# EAGLE schematic uTTA_V2.2_Measure (EAGLE 6.3)
VERSION: 2.2
Assembly variants: Manual_Adjust, Controller Adjust, Optional_content

## Sheet 1 of 5: uC & Flash
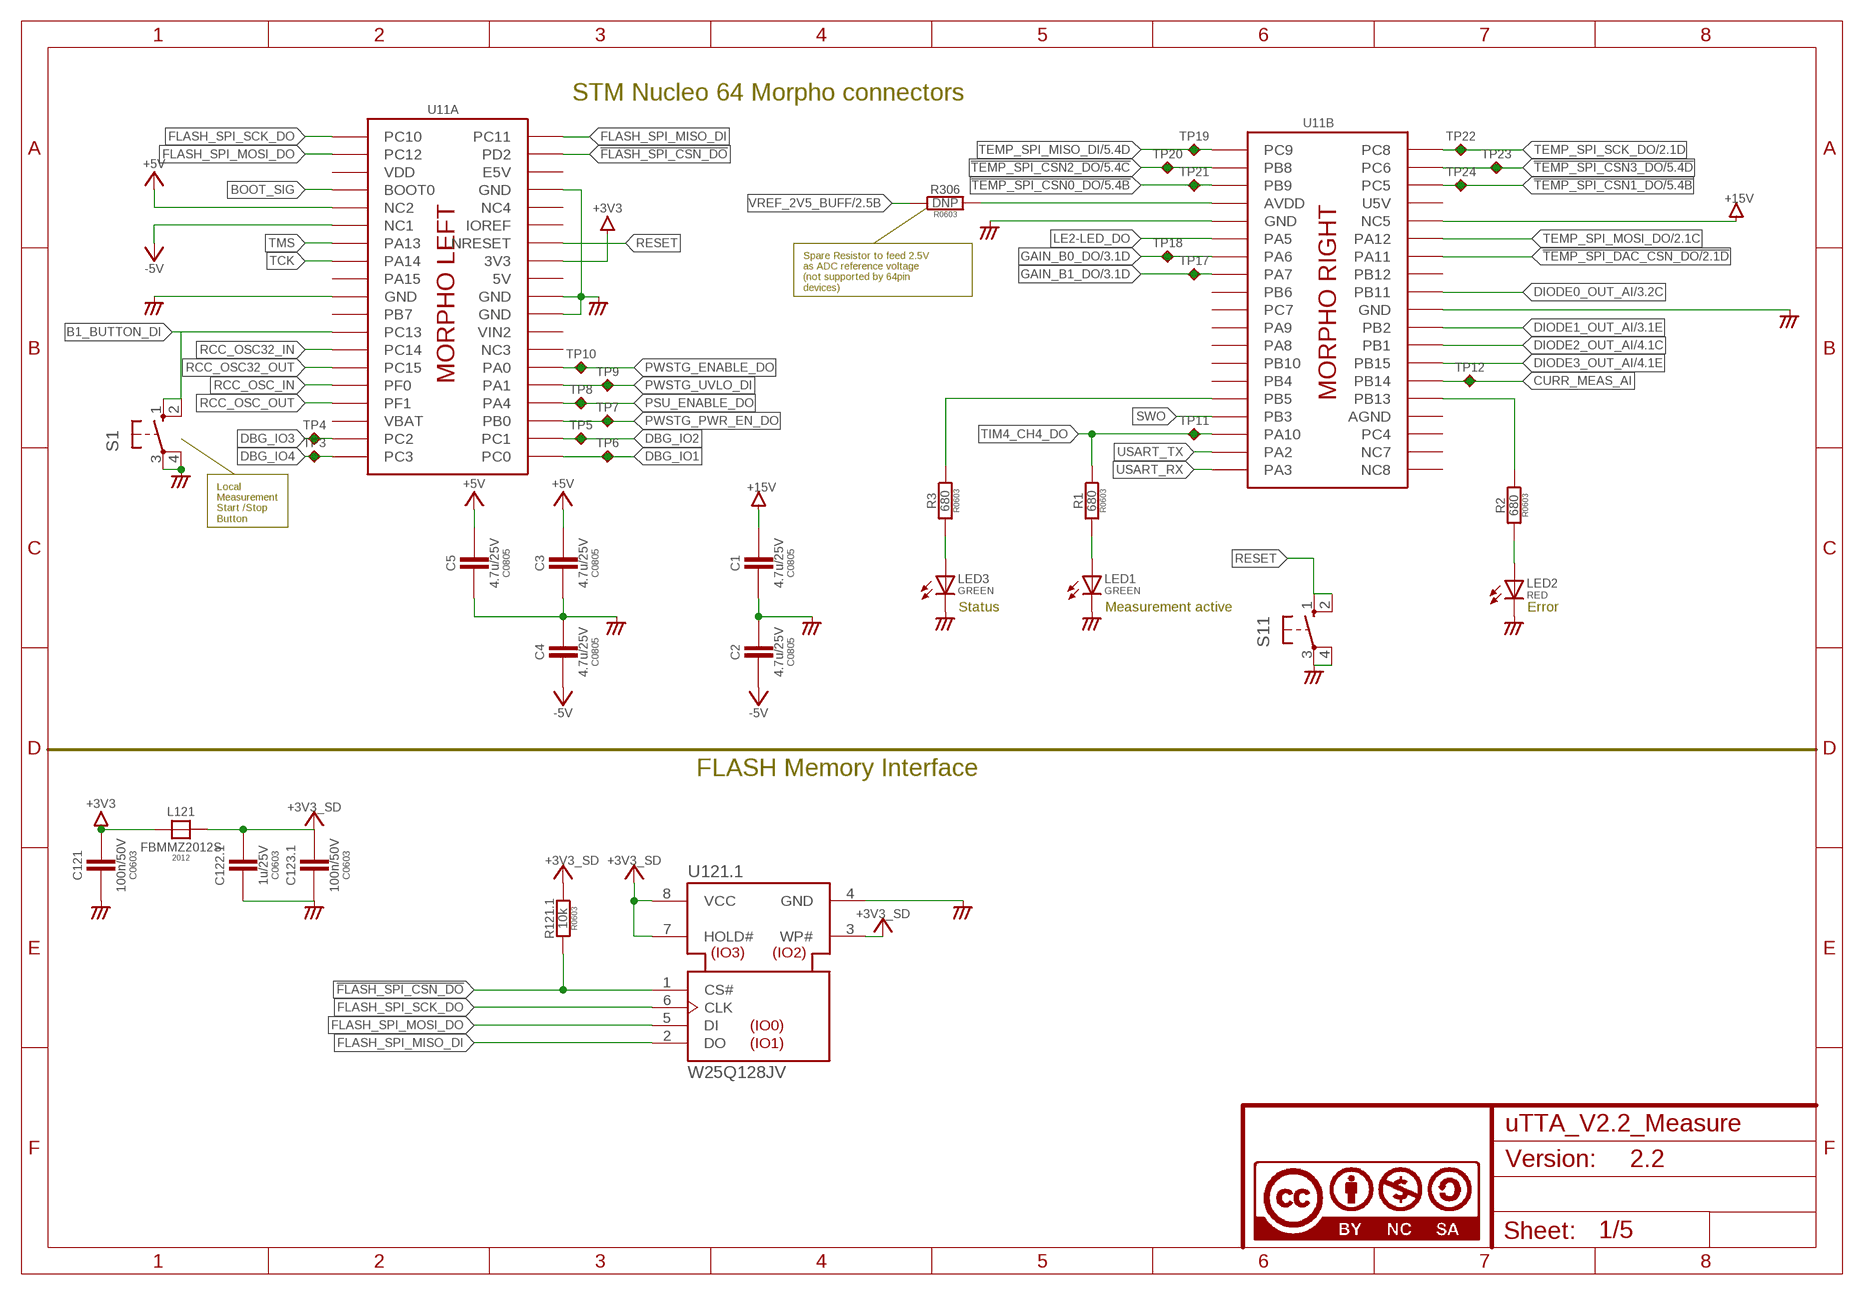
[diagram p0: schematic, sheet 1]

### Parts
C1  4.7u/25V  C-EUC0805  [C0805]  (not fitted in variant Manual_Adjust)  (not fitted in variant Controller Adjust)
C2  4.7u/25V  C-EUC0805  [C0805]  (not fitted in variant Manual_Adjust)  (not fitted in variant Controller Adjust)
C3  4.7u/25V  C-EUC0805  [C0805]  (not fitted in variant Manual_Adjust)  (not fitted in variant Controller Adjust)
C4  4.7u/25V  C-EUC0805  [C0805]  (not fitted in variant Manual_Adjust)  (not fitted in variant Controller Adjust)
C5  4.7u/25V  C-EUC0805  [C0805]  (not fitted in variant Manual_Adjust)  (not fitted in variant Controller Adjust)
C121  100n/50V  C-EUC0603  [C0603]
C122.1  1u/25V  C-EUC0603  [C0603]
C123.1  100n/50V  C-EUC0603  [C0603]
L121  FBMMZ2012S  [FB2012]
LED1  GREEN  LEDSML0805  [SML0805]
LED2  RED  LEDSML0805  [SML0805]
LED3  GREEN  LEDSML0805  [SML0805]
R1  680  R-EU_R0603  [R0603]
R2  680  R-EU_R0603  [R0603]
R3  680  R-EU_R0603  [R0603]
R121.1  10k  R-EU_R0603  [R0603]
R306  DNP  R-EU_R0603  [R0603]
S1  10-XX  [B3F-10XX]
S11  10-XX  [B3F-10XX]
TP3  TPC90H30  [C90H30]
TP4  TPC90H30  [C90H30]
TP5  TPC90H30  [C90H30]
TP6  TPC90H30  [C90H30]
TP7  TPC90H30  [C90H30]
TP8  TPC90H30  [C90H30]
TP9  TPC90H30  [C90H30]
TP10  TPC90H30  [C90H30]
TP11  TPC90H30  [C90H30]
TP12  TPC90H30  [C90H30]
TP17  TPC90H30  [C90H30]
TP18  TPC90H30  [C90H30]
TP19  TPC90H30  [C90H30]
TP20  TPC90H30  [C90H30]
TP21  TPC90H30  [C90H30]
TP22  TPC90H30  [C90H30]
TP23  TPC90H30  [C90H30]
TP24  TPC90H30  [C90H30]
U11  NUCLEO_F103_BOT  [NUCLEO_BRD64_LOWER]
U121.1  W25Q128JV  W25Q80BVSSIG  [SO08W]

### Nets
!FLASH_SPI_CSN_DO [Digital_Sig]: R121.1.2 U11.L_PD2(A:PD2) U121.1.1(CS#)
!TEMP_SPI_CSN0_DO [Digital_Sig]: TP21.P$1(TP) U11.R_PB9(B:PB9) ; also sheet 5
!TEMP_SPI_CSN1_DO [Digital_Sig]: TP24.P$1(TP) U11.R_PC5(B:PC5) ; also sheet 5
!TEMP_SPI_CSN2_DO [Digital_Sig]: TP20.P$1(TP) U11.R_PB8(B:PB8) ; also sheet 5
!TEMP_SPI_CSN3_DO [Digital_Sig]: TP23.P$1(TP) U11.R_PC6(B:PC6) ; also sheet 5
!TEMP_SPI_DAC_CSN_DO [Digital_Sig]: U11.R_PA11(B:PA11) ; also sheet 2
+3V3 [Power_<10V]: C121.1 L121.1 U11.L_3V3(A:3V3) ; also sheet 2,3,4,5
+5V [Power_<10V]: C3.1 C5.1 U11.L_NC2(A:NC2) ; also sheet 2,3,4
+5V/4 [Power_<10V]: C122.1.1 C123.1.1 L121.2 R121.1.1 U121.1.3(WP#) U121.1.7(HOLD#) U121.1.8(VCC) ; supply symbol labelled +3V3_SD
+15V [Power_>10V]: C1.1 U11.R_NC5(B:NC5) ; also sheet 2
-5V [Power_<10V]: C2.2 C4.2 U11.L_NC1(A:NC1) ; also sheet 2,3,4
AGND [GND]: C1.2 C2.1 C3.2 C4.1 C5.2 C121.2 C122.1.2 C123.1.2 LED1.C LED2.C LED3.C S1.3(P) S1.4(P1) S11.3(P) S11.4(P1) U11.L_GND3(A:GND) U11.L_GND4(A:GND) U11.L_GND5(A:GND) U11.L_GND(A:GND) U11.R_GND7(B:GND) U11.R_GND8(B:GND) U121.1.4(GND) ; supply symbol labelled AGND_ ; also sheet 2,3,4,5
B1_BUTTON_DI [Digital_Sig]: S1.1(S) S1.2(S1) U11.L_PC13(A:PC13)
BOOT_SIG: U11.L_BOOT0(A:BOOT0)
CURR_MEAS_AI [Analog_Sig]: TP12.P$1(TP) U11.R_PB14(B:PB14)
DBG_IO1: TP6.P$1(TP) U11.L_PC0(A:PC0)
DBG_IO2: TP5.P$1(TP) U11.L_PC1(A:PC1)
DBG_IO3: TP4.P$1(TP) U11.L_PC2(A:PC2)
DBG_IO4: TP3.P$1(TP) U11.L_PC3(A:PC3)
DIODE0_OUT_AI [Analog_Sig]: U11.R_PB11(B:PB11) ; also sheet 3
DIODE1_OUT_AI [Analog_Sig]: U11.R_PB2(B:PB2) ; also sheet 3
DIODE2_OUT_AI [Analog_Sig]: U11.R_PB1(B:PB1) ; also sheet 4
DIODE3_OUT_AI [Analog_Sig]: U11.R_PB15(B:PB15) ; also sheet 4
FLASH_SPI_MISO_DI [Digital_Sig]: U11.L_PC11(A:PC11) U121.1.2(DO)
FLASH_SPI_MOSI_DO [Digital_Sig]: U11.L_PC12(A:PC12) U121.1.5(DI)
FLASH_SPI_SCK_DO [Digital_Sig]: U11.L_PC10(A:PC10) U121.1.6(CLK)
GAIN_B0_DO [Digital_Sig]: TP18.P$1(TP) U11.R_PA6(B:PA6) ; also sheet 3
GAIN_B1_DO [Digital_Sig]: TP17.P$1(TP) U11.R_PA7(B:PA7) ; also sheet 3
LE2-LED_DO: U11.R_PA5(B:PA5)
N$4 [Digital_Sig]: LED2.A R2.2
N$5 [Digital_Sig]: LED3.A R3.2
N$54 [Digital_Sig]: LED1.A R1.2
PSU_ENABLE_DO [Digital_Sig]: TP8.P$1(TP) U11.L_PA4(A:PA4)
PWSTG_ENABLE_DO [Digital_Sig]: TP10.P$1(TP) U11.L_PA0(A:PA0)
PWSTG_PWR_EN_DO [Digital_Sig]: TP7.P$1(TP) U11.L_PB0(A:PB0)
PWSTG_UVLO_DI [Digital_Sig]: TP9.P$1(TP) U11.L_PA1(A:PA1)
RCC_OSC32_IN: U11.L_PC14(A:PC14)
RCC_OSC32_OUT: U11.L_PC15(A:PC15)
RCC_OSC_IN: U11.L_PF0(A:PF0)
RCC_OSC_OUT: U11.L_PF1(A:PF1)
RESET [Power_>10V]: S11.1(S) S11.2(S1) U11.L_RESET(A:NRESET)
SWO: U11.R_PB3(B:PB3)
TCK: U11.L_PA14(A:PA14)
TEMP_SPI_MISO_DI [Digital_Sig]: TP19.P$1(TP) U11.R_PC9(B:PC9) ; also sheet 5
TEMP_SPI_MOSI_DO [Digital_Sig]: U11.R_PA12(B:PA12) ; also sheet 2
TEMP_SPI_SCK_DO [Digital_Sig]: TP22.P$1(TP) U11.R_PC8(B:PC8) ; also sheet 2,5
TIM4_CH4_DO [Digital_Sig]: R1.1 TP11.P$1(TP) U11.R_PA10(B:PA10)
TIM4_CH4_DO1 [Digital_Sig]: R2.1 U11.R_PB13(B:PB13)
TIM4_CH4_DO2 [Digital_Sig]: R3.1 U11.R_PB5(B:PB5)
TMS: U11.L_PA13(A:PA13)
USART_RX: U11.R_PA3(B:PA3)
USART_TX: U11.R_PA2(B:PA2)
VREF_2V5_ADCREF [Analog_Sig]: R306.2 U11.R_AVDD(B:AVDD)
VREF_2V5_BUFF [Analog_Sig]: R306.1 ; also sheet 2
Unconnected: U11.L_IOREF(A:IOREF) U11.L_NC3(A:NC3) U11.L_NC4(A:NC4) U11.L_PA15(A:PA15) U11.L_PB7(A:PB7) U11.R_NC7(B:NC7) U11.R_NC8(B:NC8) U11.R_PA8(B:PA8) U11.R_PA9(B:PA9) U11.R_PB4(B:PB4) U11.R_PB6(B:PB6) U11.R_PB10(B:PB10) U11.R_PB12(B:PB12) U11.R_PC4(B:PC4) U11.R_PC7(B:PC7)

### Notes on the sheet
- STM Nucleo 64 Morpho connectors
- Spare Resistor to feed 2.5V 
  as ADC reference voltage
  (not supported by 64pin
  devices)
- Local
  Measurement
  Start /Stop
  Button
- Status | Measurement active | Error
- FLASH Memory Interface

## Sheet 2 of 5
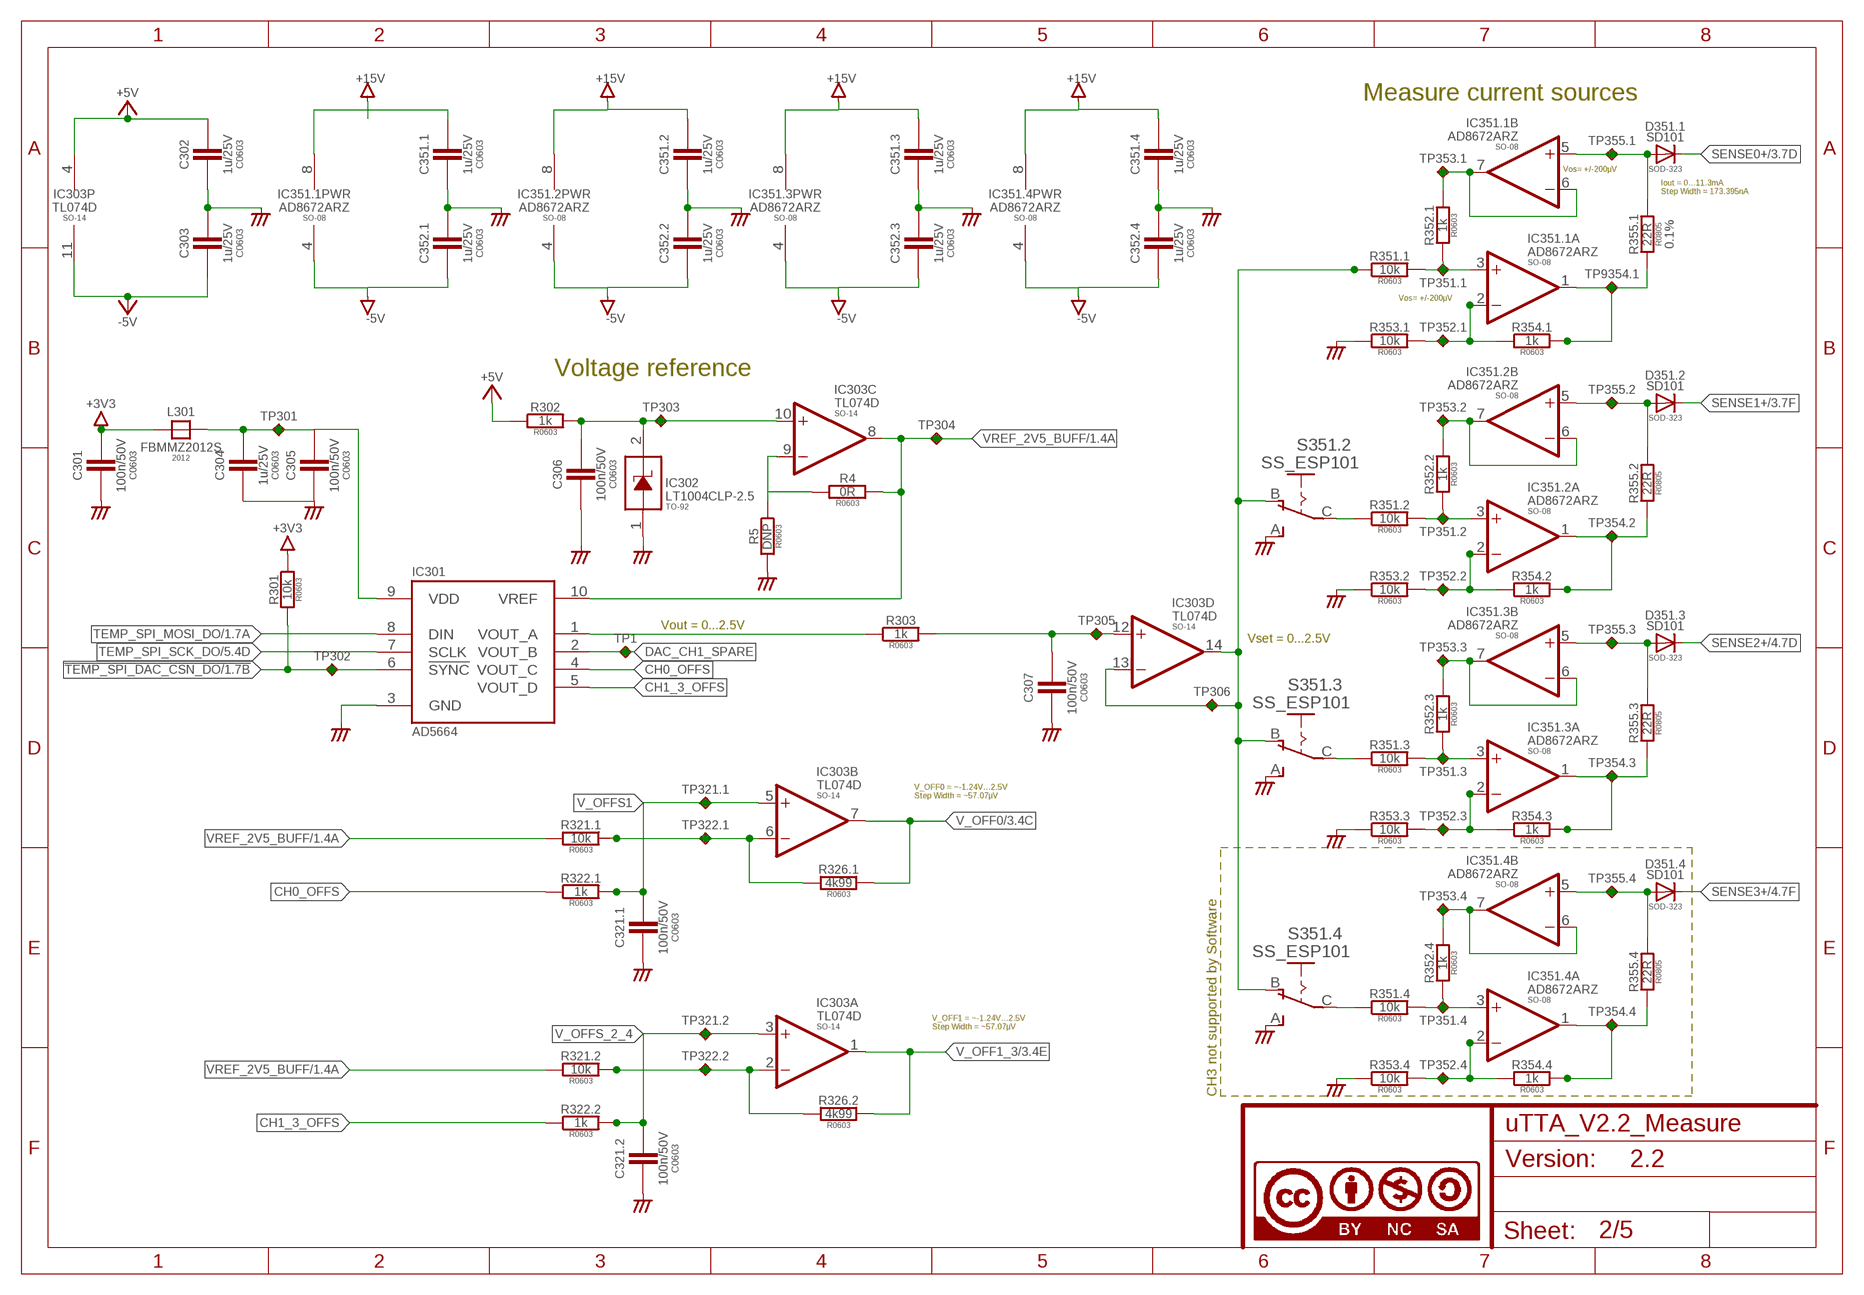
[diagram p1: schematic, sheet 2]

### Parts
C301  100n/50V  C-EUC0603  [C0603]  (not fitted in variant Manual_Adjust)
C302  1u/25V  C-EUC0603  [C0603]
C303  1u/25V  C-EUC0603  [C0603]
C304  1u/25V  C-EUC0603  [C0603]
C305  100n/50V  C-EUC0603  [C0603]  (not fitted in variant Manual_Adjust)
C306  100n/50V  C-EUC0603  [C0603]
C307  100n/50V  C-EUC0603  [C0603]
C321.1  100n/50V  C-EUC0603  [C0603]
C321.2  100n/50V  C-EUC0603  [C0603]
C351.1  1u/25V  C-EUC0603  [C0603]
C351.2  1u/25V  C-EUC0603  [C0603]
C351.3  1u/25V  C-EUC0603  [C0603]
C351.4  1u/25V  C-EUC0603  [C0603]  (not fitted in variant Manual_Adjust)  (not fitted in variant Controller Adjust)
C352.1  1u/25V  C-EUC0603  [C0603]
C352.2  1u/25V  C-EUC0603  [C0603]
C352.3  1u/25V  C-EUC0603  [C0603]
C352.4  1u/25V  C-EUC0603  [C0603]  (not fitted in variant Manual_Adjust)  (not fitted in variant Controller Adjust)
D351.1  SD101  SD101AWS  [SOD323-R]
D351.2  SD101  SD101AWS  [SOD323-R]
D351.3  SD101  SD101AWS  [SOD323-R]
D351.4  SD101  SD101AWS  [SOD323-R]  (not fitted in variant Manual_Adjust)  (not fitted in variant Controller Adjust)
IC301  AD5664  AD5664R  [MSOP10]  (not fitted in variant Manual_Adjust)
IC302  LT1004CLP-2.5  [TO92-]
IC303  TL074D  [SO14]
IC351.1  AD8672ARZ  OPA2156ID  [SO08]
IC351.2  AD8672ARZ  OPA2156ID  [SO08]
IC351.3  AD8672ARZ  OPA2156ID  [SO08]
IC351.4  AD8672ARZ  OPA2156ID  [SO08]  (not fitted in variant Manual_Adjust)  (not fitted in variant Controller Adjust)
L301  FBMMZ2012S  [FB2012]  (not fitted in variant Manual_Adjust)
R4  0R  R-EU_R0603  [R0603]
R5  DNP  R-EU_R0603  [R0603]
R301  10k  R-EU_R0603  [R0603]  (not fitted in variant Manual_Adjust)
R302  1k  R-EU_R0603  [R0603]
R303  1k  R-EU_R0603  [R0603]  (not fitted in variant Manual_Adjust)
R321.1  10k  R-EU_R0603  [R0603]
R321.2  10k  R-EU_R0603  [R0603]
R322.1  1k  R-EU_R0603  [R0603]  (not fitted in variant Manual_Adjust)
R322.2  1k  R-EU_R0603  [R0603]  (not fitted in variant Manual_Adjust)
R326.1  4k99  R-EU_R0603  [R0603]
R326.2  4k99  R-EU_R0603  [R0603]
R351.1  10k  R-EU_R0603  [R0603]
R351.2  10k  R-EU_R0603  [R0603]
R351.3  10k  R-EU_R0603  [R0603]
R351.4  10k  R-EU_R0603  [R0603]  (not fitted in variant Manual_Adjust)  (not fitted in variant Controller Adjust)
R352.1  1k  R-EU_R0603  [R0603]
R352.2  1k  R-EU_R0603  [R0603]
R352.3  1k  R-EU_R0603  [R0603]
R352.4  1k  R-EU_R0603  [R0603]  (not fitted in variant Manual_Adjust)  (not fitted in variant Controller Adjust)
R353.1  10k  R-EU_R0603  [R0603]
R353.2  10k  R-EU_R0603  [R0603]
R353.3  10k  R-EU_R0603  [R0603]
R353.4  10k  R-EU_R0603  [R0603]  (not fitted in variant Manual_Adjust)  (not fitted in variant Controller Adjust)
R354.1  1k  R-EU_R0603  [R0603]
R354.2  1k  R-EU_R0603  [R0603]
R354.3  1k  R-EU_R0603  [R0603]
R354.4  1k  R-EU_R0603  [R0603]  (not fitted in variant Manual_Adjust)  (not fitted in variant Controller Adjust)
R355.1  22R  R-EU_R0805  [R0805]
R355.2  22R  R-EU_R0805  [R0805]
R355.3  22R  R-EU_R0805  [R0805]
R355.4  22R  R-EU_R0805  [R0805]  (not fitted in variant Manual_Adjust)  (not fitted in variant Controller Adjust)
S351.2  SS_ESP101  [SS_ESP101]
S351.3  SS_ESP101  [SS_ESP101]
S351.4  SS_ESP101  [SS_ESP101]  (not fitted in variant Manual_Adjust)  (not fitted in variant Controller Adjust)
TP1  TPC90  [C90]
TP301  TPC90  [C90]
TP302  TPC90  [C90]
TP303  TPC90H30  [C90H30]
TP304  TPC90  [C90]
TP305  TPC90H30  [C90H30]
TP306  TPC90  [C90]
TP321.1  TPC90  [C90]
TP321.2  TPC90  [C90]
TP322.1  TPC90  [C90]
TP322.2  TPC90  [C90]
TP351.1  TPC90  [C90]
TP351.2  TPC90  [C90]
TP351.3  TPC90  [C90]
TP351.4  TPC90  [C90]
TP352.1  TPC90  [C90]
TP352.2  TPC90  [C90]
TP352.3  TPC90  [C90]
TP352.4  TPC90  [C90]
TP353.1  TPC90  [C90]
TP353.2  TPC90  [C90]
TP353.3  TPC90  [C90]
TP353.4  TPC90  [C90]
TP354.2  TPC90  [C90]
TP354.3  TPC90  [C90]
TP354.4  TPC90  [C90]
TP355.1  TPC90  [C90]
TP355.2  TPC90  [C90]
TP355.3  TPC90  [C90]
TP355.4  TPC90  [C90]
TP9354.1  TPC90  [C90]

### Nets
3V3_DAC [Power_<10V]: C304.1 C305.1 IC301.9(VDD) L301.2 TP301.P$1(TP)
!TEMP_SPI_DAC_CSN_DO [Digital_Sig]: IC301.6(!SYNC) R301.2 TP302.P$1(TP) ; also sheet 1
+3V3 [Power_<10V]: C301.1 L301.1 R301.1 ; also sheet 1,3,4,5
+5V [Power_<10V]: C302.1 IC303.4(P:V+) R302.1 ; also sheet 1,3,4
+15V [Power_>10V]: C351.1.1 C351.2.1 C351.3.1 C351.4.1 IC351.1.8(PWR:V+) IC351.2.8(PWR:V+) IC351.3.8(PWR:V+) IC351.4.8(PWR:V+) ; also sheet 1
-5V [Power_<10V]: C303.2 C352.1.2 C352.2.2 C352.3.2 C352.4.2 IC303.11(P:V-) IC351.1.4(PWR:V-) IC351.2.4(PWR:V-) IC351.3.4(PWR:V-) IC351.4.4(PWR:V-) ; also sheet 1,3,4
AGND [GND]: C301.2 C302.2 C303.1 C304.2 C305.2 C306.2 C307.2 C321.1.2 C321.2.2 C351.1.2 C351.2.2 C351.3.2 C351.4.2 C352.1.1 C352.2.1 C352.3.1 C352.4.1 IC301.3(GND) IC302.1(A) R5.2 R353.1.1 R353.2.1 R353.3.1 R353.4.1 S351.2.A(S) S351.3.A(S) S351.4.A(S) ; supply symbol labelled AGND_ ; also sheet 1,3,4,5
CH0_OFFS [Analog_Sig]: IC301.4(VOUT_C) R322.1.1
CH1_3_OFFS [Analog_Sig]: IC301.5(VOUT_D) R322.2.1
DAC_CH1_SPARE [Analog_Sig]: IC301.2(VOUT_B) TP1.P$1(TP)
I_SENSE_DAC_SET [Analog_Sig]: IC301.1(VOUT_A) R303.1
ISEN_FB1 [Analog_Sig]: D351.1.A IC351.1.5(B:+IN) R355.1.2 TP355.1.P$1(TP)
ISEN_FB2 [Analog_Sig]: D351.2.A IC351.2.5(B:+IN) R355.2.2 TP355.2.P$1(TP)
ISEN_FB3 [Analog_Sig]: D351.3.A IC351.3.5(B:+IN) R355.3.2 TP355.3.P$1(TP)
ISEN_FB4 [Analog_Sig]: D351.4.A IC351.4.5(B:+IN) R355.4.2 TP355.4.P$1(TP)
ISEN_FB_OUT1 [Analog_Sig]: IC351.1.6(B:-IN) IC351.1.7(B:OUT) R352.1.2 TP353.1.P$1(TP)
ISEN_FB_OUT2 [Analog_Sig]: IC351.2.6(B:-IN) IC351.2.7(B:OUT) R352.2.2 TP353.2.P$1(TP)
ISEN_FB_OUT3 [Analog_Sig]: IC351.3.6(B:-IN) IC351.3.7(B:OUT) R352.3.2 TP353.3.P$1(TP)
ISEN_FB_OUT4 [Analog_Sig]: IC351.4.6(B:-IN) IC351.4.7(B:OUT) R352.4.2 TP353.4.P$1(TP)
ISEN_FB_SUM1 [Analog_Sig]: IC351.1.2(A:-IN) R353.1.2 R354.1.1 TP352.1.P$1(TP)
ISEN_FB_SUM2 [Analog_Sig]: IC351.2.2(A:-IN) R353.2.2 R354.2.1 TP352.2.P$1(TP)
ISEN_FB_SUM3 [Analog_Sig]: IC351.3.2(A:-IN) R353.3.2 R354.3.1 TP352.3.P$1(TP)
ISEN_FB_SUM4 [Analog_Sig]: IC351.4.2(A:-IN) R353.4.2 R354.4.1 TP352.4.P$1(TP)
ISEN_OUT1 [Analog_Sig]: IC351.1.1(A:OUT) R354.1.2 R355.1.1 TP9354.1.P$1(TP)
ISEN_OUT2 [Analog_Sig]: IC351.2.1(A:OUT) R354.2.2 R355.2.1 TP354.2.P$1(TP)
ISEN_OUT3 [Analog_Sig]: IC351.3.1(A:OUT) R354.3.2 R355.3.1 TP354.3.P$1(TP)
ISEN_OUT4 [Analog_Sig]: IC351.4.1(A:OUT) R354.4.2 R355.4.1 TP354.4.P$1(TP)
ISEN_SET2 [Analog_Sig]: R351.2.1 S351.2.C(P)
ISEN_SET3 [Analog_Sig]: R351.3.1 S351.3.C(P)
ISEN_SET4 [Analog_Sig]: R351.4.1 S351.4.C(P)
ISEN_SET_SUM1 [Analog_Sig]: IC351.1.3(A:+IN) R351.1.2 R352.1.1 TP351.1.P$1(TP)
ISEN_SET_SUM2 [Analog_Sig]: IC351.2.3(A:+IN) R351.2.2 R352.2.1 TP351.2.P$1(TP)
ISEN_SET_SUM3 [Analog_Sig]: IC351.3.3(A:+IN) R351.3.2 R352.3.1 TP351.3.P$1(TP)
ISEN_SET_SUM4 [Analog_Sig]: IC351.4.3(A:+IN) R351.4.2 R352.4.1 TP351.4.P$1(TP)
ISENS_SET [Analog_Sig]: IC303.13(D:-IN) IC303.14(D:OUT) R351.1.1 S351.2.B(O) S351.3.B(O) S351.4.B(O) TP306.P$1(TP)
ISENS_SET_IN [Analog_Sig]: C307.1 IC303.12(D:+IN) R303.2 TP305.P$1(TP)
N$3: IC303.9(C:-IN) R4.2 R5.1
SENSE0+ [Analog_Sig]: D351.1.C ; also sheet 3
SENSE1+ [Analog_Sig]: D351.2.C ; also sheet 3
SENSE2+ [Analog_Sig]: D351.3.C ; also sheet 4
SENSE3+ [Analog_Sig]: D351.4.C ; also sheet 4
TEMP_SPI_MOSI_DO [Digital_Sig]: IC301.8(DIN) ; also sheet 1
TEMP_SPI_SCK_DO [Digital_Sig]: IC301.7(SCLK) ; also sheet 1,5
V_OFF0 [Analog_Sig]: IC303.7(B:OUT) R326.1.1 ; also sheet 3
V_OFF1_3 [Analog_Sig]: IC303.1(A:OUT) R326.2.1 ; also sheet 3,4
V_OFFS1 [Analog_Sig]: C321.1.1 IC303.5(B:+IN) R322.1.2 TP321.1.P$1(TP)
V_OFFS_2_4 [Analog_Sig]: C321.2.1 IC303.3(A:+IN) R322.2.2 TP321.2.P$1(TP)
VOFFS_RR1 [Analog_Sig]: IC303.6(B:-IN) R321.1.1 R326.1.2 TP322.1.P$1(TP)
VOFFS_RR2_4 [Analog_Sig]: IC303.2(A:-IN) R321.2.1 R326.2.2 TP322.2.P$1(TP)
VREF [Analog_Sig]: C306.1 IC302.2(C) IC303.10(C:+IN) R302.2 TP303.P$1(TP)
VREF_2V5_BUFF [Analog_Sig]: IC301.10(VREF) IC303.8(C:OUT) R4.1 R321.1.2 R321.2.2 TP304.P$1(TP) ; also sheet 1

### Notes on the sheet
- Measure current sources
- Vos= +/-200µV
- Iout = 0...11.3mA
  Step Width = 173.395nA
- Vos= +/-200µV
- Voltage reference
- Vout = 0...2.5V
- Vset = 0...2.5V
- V_OFF0 = ~-1.24V...2.5V
  Step Width = ~57.07µV
- V_OFF1 = ~-1.24V...2.5V
  Step Width = ~57.07µV
- CH3 not supported by Software

## Sheet 3 of 5: Measure Channels 0 & 1
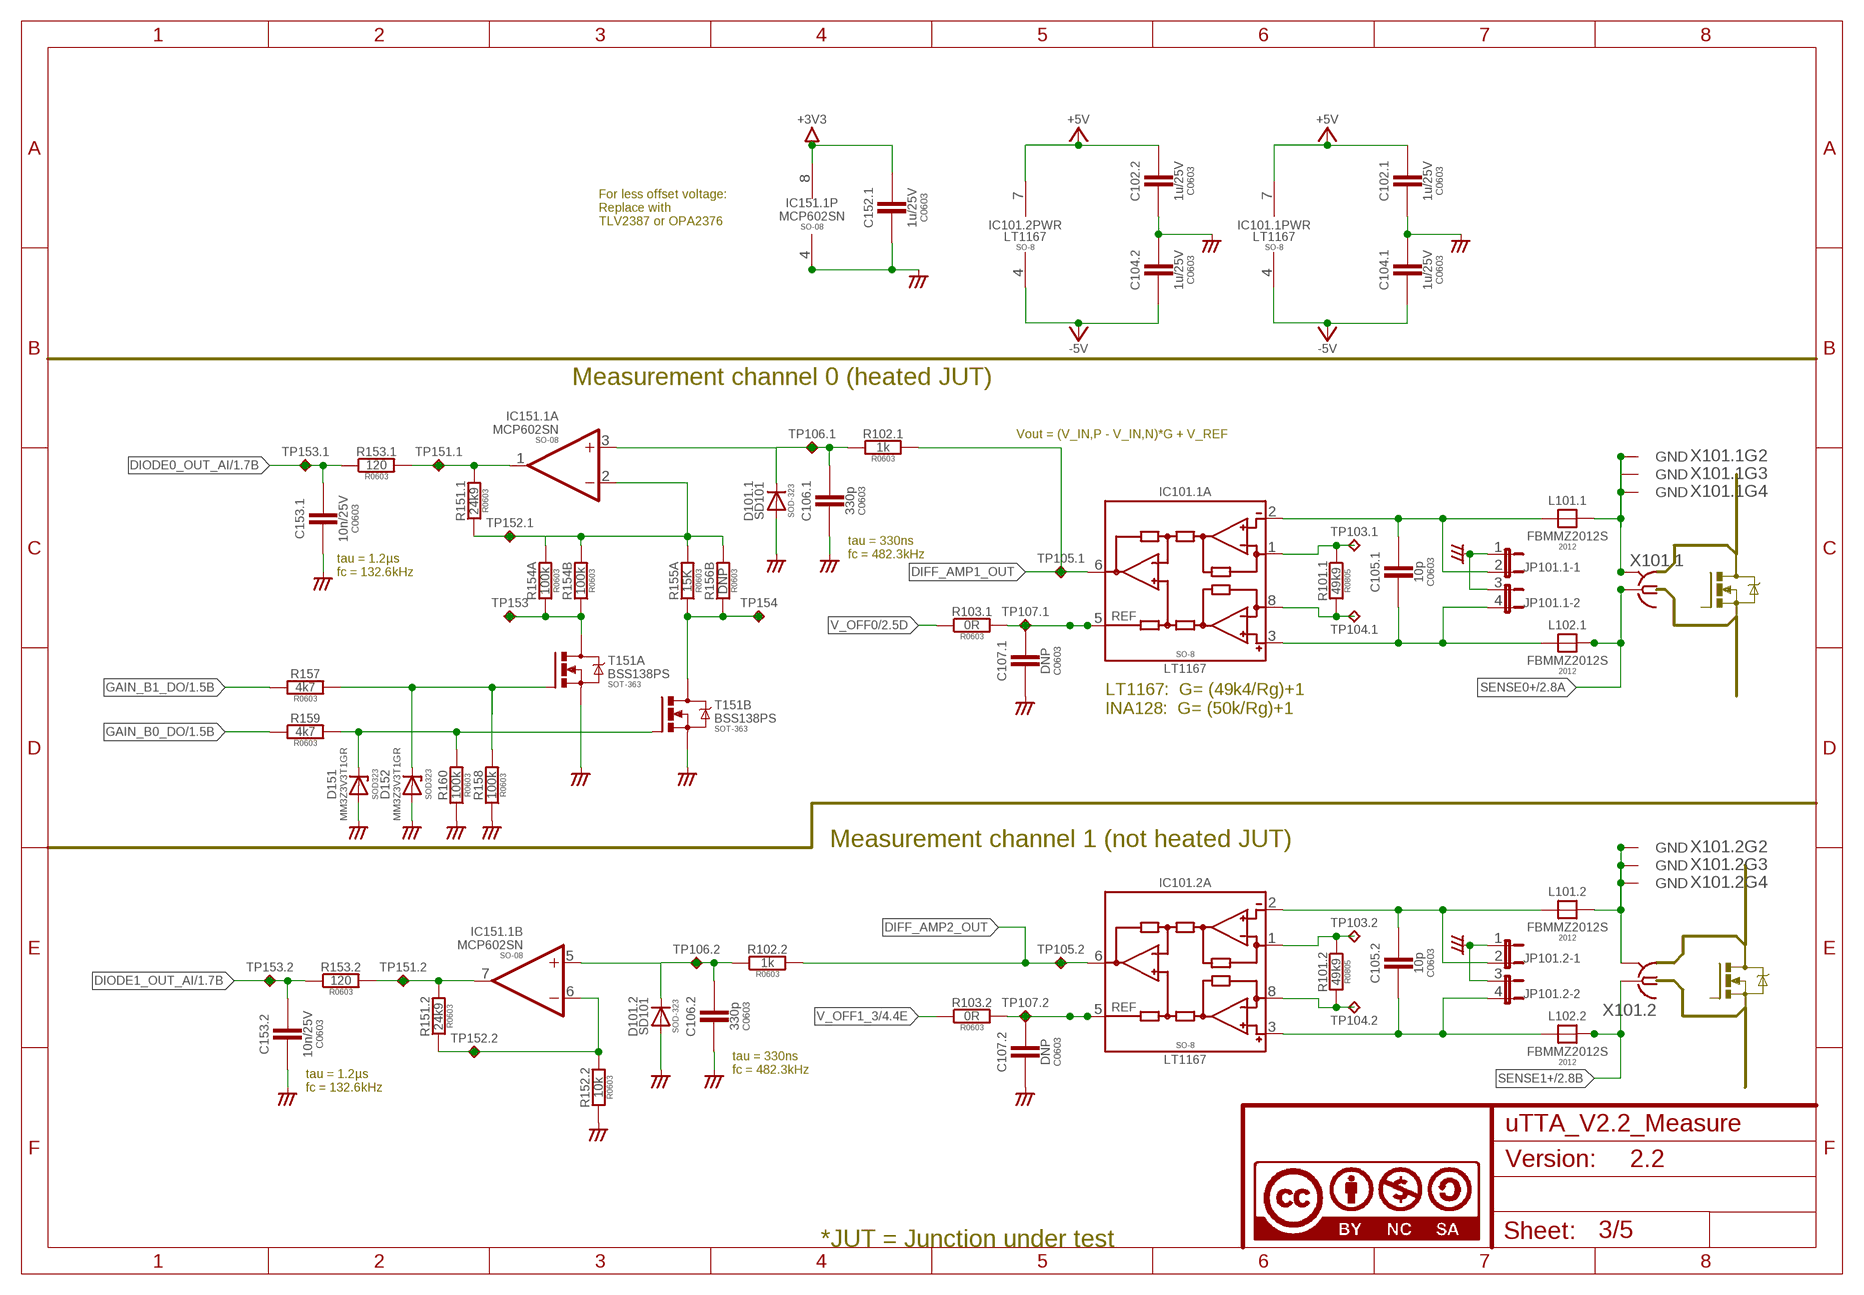
[diagram p2: schematic, sheet 3]

### Parts
C102.1  1u/25V  C-EUC0603  [C0603]
C102.2  1u/25V  C-EUC0603  [C0603]
C104.1  1u/25V  C-EUC0603  [C0603]
C104.2  1u/25V  C-EUC0603  [C0603]
C105.1  10p  C-EUC0603  [C0603]
C105.2  10p  C-EUC0603  [C0603]
C106.1  330p  C-EUC0603  [C0603]
C106.2  330p  C-EUC0603  [C0603]
C107.1  DNP  C-EUC0603  [C0603]
C107.2  DNP  C-EUC0603  [C0603]
C152.1  1u/25V  C-EUC0603  [C0603]
C153.1  10n/25V  C-EUC0603  [C0603]
C153.2  10n/25V  C-EUC0603  [C0603]
D101.1  SD101  SD101AWS  [SOD323-R]
D101.2  SD101  SD101AWS  [SOD323-R]
D151  MM3Z3V3T1GR  [SOD323-R]
D152  MM3Z3V3T1GR  [SOD323-R]
IC101.1  LT1167  [SO08]
IC101.2  LT1167  [SO08]
IC151.1  MCP602SN  [SO08]
JP101.1  JP2QE  [JP2Q]
JP101.2  JP2QE  [JP2Q]
L101.1  FBMMZ2012S  [FB2012]
L101.2  FBMMZ2012S  [FB2012]
L102.1  FBMMZ2012S  [FB2012]
L102.2  FBMMZ2012S  [FB2012]
R101.1  49k9  R-EU_R0805  [R0805]
R101.2  49k9  R-EU_R0805  [R0805]
R102.1  1k  R-EU_R0603  [R0603]
R102.2  1k  R-EU_R0603  [R0603]
R103.1  0R  R-EU_R0603  [R0603]
R103.2  0R  R-EU_R0603  [R0603]
R151.1  24k9  R-EU_R0603  [R0603]
R151.2  24k9  R-EU_R0603  [R0603]
R152.2  10k  R-EU_R0603  [R0603]
R153.1  120  R-EU_R0603  [R0603]
R153.2  120  R-EU_R0603  [R0603]
R154A  100k  R-EU_R0603  [R0603]
R154B  100k  R-EU_R0603  [R0603]
R155A  15K  R-EU_R0603  [R0603]
R156B  DNP  R-EU_R0603  [R0603]
R157  4k7  R-EU_R0603  [R0603]
R158  100k  R-EU_R0603  [R0603]
R159  4k7  R-EU_R0603  [R0603]
R160  100k  R-EU_R0603  [R0603]
T151  BSS138PS  [SOT363_PHILIPS]
TP103.1  TPC90  [C90]
TP103.2  TPC90  [C90]
TP104.1  TPC90  [C90]
TP104.2  TPC90  [C90]
TP105.1  TPC90  [C90]
TP105.2  TPC90  [C90]
TP106.1  TPC90H30  [C90H30]
TP106.2  TPC90H30  [C90H30]
TP107.1  TPC90  [C90]
TP107.2  TPC90  [C90]
TP151.1  TPC90H30  [C90H30]
TP151.2  TPC90H30  [C90H30]
TP152.1  TPC90  [C90]
TP152.2  TPC90  [C90]
TP153  TPC90  [C90]
TP153.1  TPC90H30  [C90H30]
TP153.2  TPC90H30  [C90H30]
TP154  TPC90  [C90]
X101.1  BU-SMA-GSPECIAL  [BU_SMA_3P]
X101.2  BU-SMA-GSPECIAL  [BU_SMA_3P]

### Nets
+3V3 [Power_<10V]: C152.1.1 IC151.1.8(P:V+) ; also sheet 1,2,4,5
+5V [Power_<10V]: C102.1.1 C102.2.1 IC101.1.7(PWR:V+) IC101.2.7(PWR:V+) ; also sheet 1,2,4
-5V [Power_<10V]: C104.1.2 C104.2.2 IC101.1.4(PWR:V-) IC101.2.4(PWR:V-) ; also sheet 1,2,4
AGND [GND]: C102.1.2 C102.2.2 C104.1.1 C104.2.1 C106.1.2 C106.2.2 C107.1.2 C107.2.2 C152.1.2 C153.1.2 C153.2.2 D101.1.A D101.2.A D151.A D152.A IC151.1.4(P:V-) JP101.1.1 JP101.1.3 JP101.2.1 JP101.2.3 R152.2.1 R158.1 R160.1 T151.1(A:S) T151.4(B:S) ; supply symbol labelled AGND_ ; also sheet 1,2,4,5
AMP1_OUT [Analog_Sig]: IC151.1.1(A:OUT) R151.1.2 R153.1.2 TP151.1.P$1(TP)
AMP1_RG_B0 [Analog_Sig]: R155A.1 R156B.1 T151.6(B:D) TP154.P$1(TP)
AMP1_RG_B1 [Analog_Sig]: R154A.1 R154B.1 T151.3(A:D) TP153.P$1(TP)
AMP2_FB [Analog_Sig]: IC151.1.6(B:-IN) R151.2.1 R152.2.2 TP152.2.P$1(TP)
AMP2_OUT [Analog_Sig]: IC151.1.7(B:OUT) R151.2.2 R153.2.2 TP151.2.P$1(TP)
B0_GATE [Digital_Sig]: D151.C R159.2 R160.2 T151.5(B:G)
B1_GATE [Digital_Sig]: D152.C R157.2 R158.2 T151.2(A:G)
DIFF_AMP1_OUT [Analog_Sig]: IC101.1.6(A:OUT) R102.1.2 TP105.1.P$1(TP)
DIFF_AMP2_OUT [Analog_Sig]: IC101.2.6(A:OUT) R102.2.2 TP105.2.P$1(TP)
DIODE0_OUT_AI [Analog_Sig]: C153.1.1 R153.1.1 TP153.1.P$1(TP) ; also sheet 1
DIODE1_OUT_AI [Analog_Sig]: C153.2.1 R153.2.1 TP153.2.P$1(TP) ; also sheet 1
DIODE2_IN [Analog_Sig]: C106.2.1 D101.2.C IC151.1.5(B:+IN) R102.2.1 TP106.2.P$1(TP)
GAIN1+ [Analog_Sig]: IC101.1.8(A:RG) R101.1.2 TP104.1.P$1(TP)
GAIN1- [Analog_Sig]: IC101.1.1(A:RG) R101.1.1 TP103.1.P$1(TP)
GAIN2+ [Analog_Sig]: IC101.2.8(A:RG) R101.2.2 TP104.2.P$1(TP)
GAIN2- [Analog_Sig]: IC101.2.1(A:RG) R101.2.1 TP103.2.P$1(TP)
GAIN_B0_DO [Digital_Sig]: R159.1 ; also sheet 1
GAIN_B1_DO [Digital_Sig]: R157.1 ; also sheet 1
IN1+ [Analog_Sig]: C105.1.2 IC101.1.3(A:+IN) JP101.1.4 L102.1.1
IN1- [Analog_Sig]: C105.1.1 IC101.1.2(A:-IN) JP101.1.2 L101.1.1
IN2+ [Analog_Sig]: C105.2.2 IC101.2.3(A:+IN) JP101.2.4 L102.2.1
IN2- [Analog_Sig]: C105.2.1 IC101.2.2(A:-IN) JP101.2.2 L101.2.1
PGA_DIODE1_IN [Analog_Sig]: C106.1.1 D101.1.C IC151.1.3(A:+IN) R102.1.1 TP106.1.P$1(TP)
SENSE0+ [Analog_Sig]: L102.1.2 X101.1.C1 X101.1.C2 ; also sheet 2
SENSE1+ [Analog_Sig]: L102.2.2 X101.2.C1 X101.2.C2 ; also sheet 2
SENSE1- [Analog_Sig]: L101.1.2 X101.1.@GND1(GND) X101.1.@GND2(GND) X101.1.@GND3(GND) X101.1.@GND4(GND) X101.1.GND
SENSE2- [Analog_Sig]: L101.2.2 X101.2.@GND1(GND) X101.2.@GND2(GND) X101.2.@GND3(GND) X101.2.@GND4(GND) X101.2.GND
TP152.1 [Analog_Sig]: IC151.1.2(A:-IN) R151.1.1 R154A.2 R154B.2 R155A.2 R156B.2 TP152.1.P$1(TP)
V_OFF0 [Analog_Sig]: R103.1.1 ; also sheet 2
V_OFF1_3 [Analog_Sig]: R103.2.1 ; also sheet 2,4
V_OPREF1 [Analog_Sig]: C107.1.1 IC101.1.5(A:REF) R103.1.2 TP107.1.P$1(TP)
V_OPREF2 [Analog_Sig]: C107.2.1 IC101.2.5(A:REF) R103.2.2 TP107.2.P$1(TP)

### Notes on the sheet
- For less offset voltage:
  Replace with 
  TLV2387 or OPA2376
- Measurement channel 0 (heated JUT)
- Vout = (V_IN,P - V_IN,N)*G + V_REF
- tau = 330ns
  fc = 482.3kHz
- tau = 1.2µs
  fc = 132.6kHz
- LT1167:  G= (49k4/Rg)+1
  INA128:  G= (50k/Rg)+1
- Measurement channel 1 (not heated JUT)
- tau = 330ns
  fc = 482.3kHz
- tau = 1.2µs
  fc = 132.6kHz
- *JUT = Junction under test

## Sheet 4 of 5: Measure Channels 2 & 3
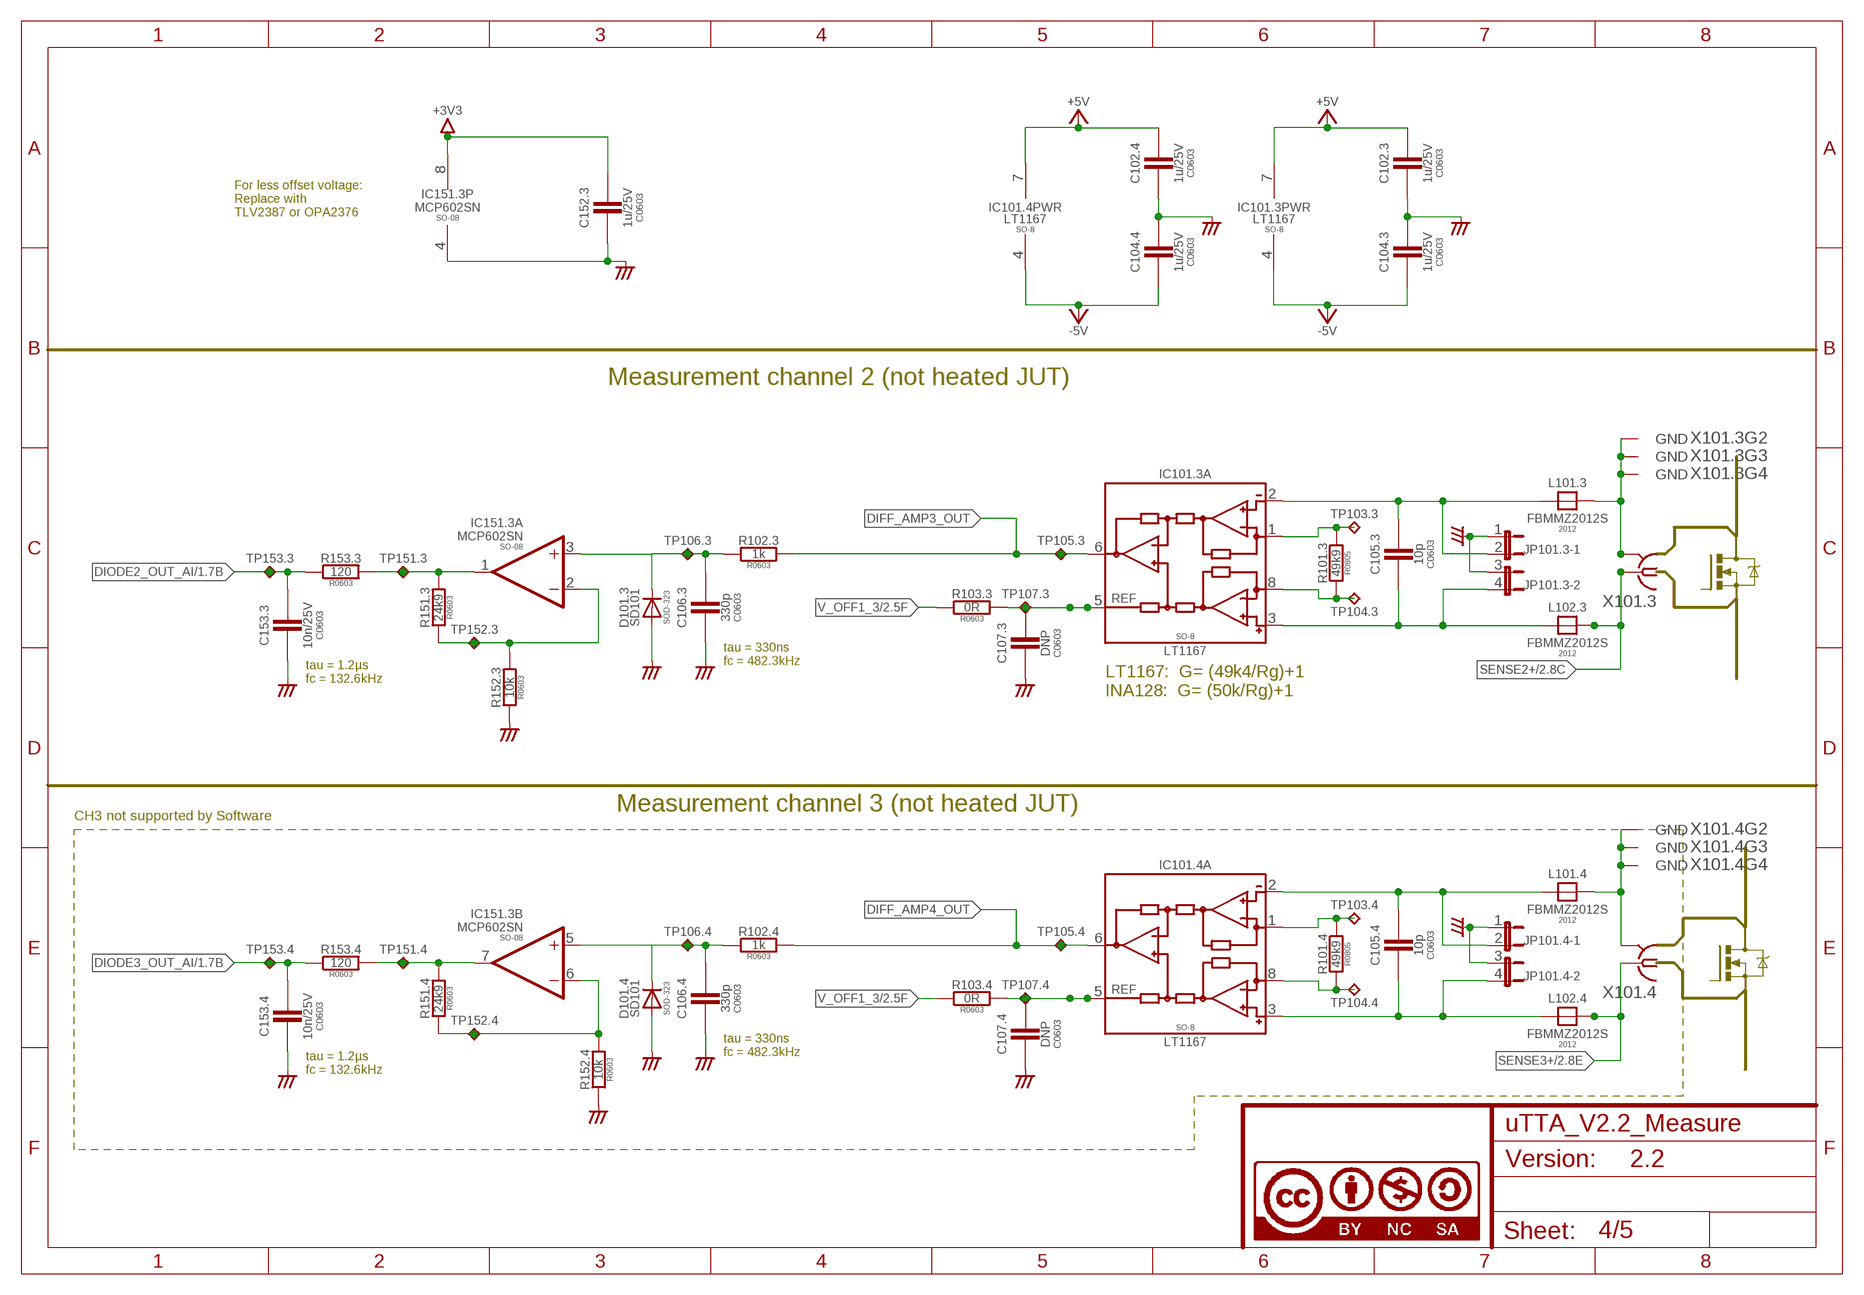
[diagram p3: schematic, sheet 4]

### Parts
C102.3  1u/25V  C-EUC0603  [C0603]
C102.4  1u/25V  C-EUC0603  [C0603]  (not fitted in variant Manual_Adjust)  (not fitted in variant Controller Adjust)
C104.3  1u/25V  C-EUC0603  [C0603]
C104.4  1u/25V  C-EUC0603  [C0603]  (not fitted in variant Manual_Adjust)  (not fitted in variant Controller Adjust)
C105.3  10p  C-EUC0603  [C0603]
C105.4  10p  C-EUC0603  [C0603]  (not fitted in variant Manual_Adjust)  (not fitted in variant Controller Adjust)
C106.3  330p  C-EUC0603  [C0603]
C106.4  330p  C-EUC0603  [C0603]  (not fitted in variant Manual_Adjust)  (not fitted in variant Controller Adjust)
C107.3  DNP  C-EUC0603  [C0603]
C107.4  DNP  C-EUC0603  [C0603]  (not fitted in variant Manual_Adjust)  (not fitted in variant Controller Adjust)
C152.3  1u/25V  C-EUC0603  [C0603]
C153.3  10n/25V  C-EUC0603  [C0603]
C153.4  10n/25V  C-EUC0603  [C0603]  (not fitted in variant Manual_Adjust)  (not fitted in variant Controller Adjust)
D101.3  SD101  SD101AWS  [SOD323-R]
D101.4  SD101  SD101AWS  [SOD323-R]  (not fitted in variant Manual_Adjust)  (not fitted in variant Controller Adjust)
IC101.3  LT1167  [SO08]
IC101.4  LT1167  [SO08]  (not fitted in variant Manual_Adjust)  (not fitted in variant Controller Adjust)
IC151.3  MCP602SN  [SO08]
JP101.3  JP2QE  [JP2Q]
JP101.4  JP2QE  [JP2Q]
L101.3  FBMMZ2012S  [FB2012]
L101.4  FBMMZ2012S  [FB2012]  (not fitted in variant Manual_Adjust)  (not fitted in variant Controller Adjust)
L102.3  FBMMZ2012S  [FB2012]
L102.4  FBMMZ2012S  [FB2012]  (not fitted in variant Manual_Adjust)  (not fitted in variant Controller Adjust)
R101.3  49k9  R-EU_R0805  [R0805]
R101.4  49k9  R-EU_R0805  [R0805]  (not fitted in variant Manual_Adjust)  (not fitted in variant Controller Adjust)
R102.3  1k  R-EU_R0603  [R0603]
R102.4  1k  R-EU_R0603  [R0603]  (not fitted in variant Manual_Adjust)  (not fitted in variant Controller Adjust)
R103.3  0R  R-EU_R0603  [R0603]
R103.4  0R  R-EU_R0603  [R0603]  (not fitted in variant Manual_Adjust)
R151.3  24k9  R-EU_R0603  [R0603]
R151.4  24k9  R-EU_R0603  [R0603]  (not fitted in variant Manual_Adjust)  (not fitted in variant Controller Adjust)
R152.3  10k  R-EU_R0603  [R0603]
R152.4  10k  R-EU_R0603  [R0603]  (not fitted in variant Manual_Adjust)  (not fitted in variant Controller Adjust)
R153.3  120  R-EU_R0603  [R0603]
R153.4  120  R-EU_R0603  [R0603]  (not fitted in variant Manual_Adjust)  (not fitted in variant Controller Adjust)
TP103.3  TPC90  [C90]
TP103.4  TPC90  [C90]
TP104.3  TPC90  [C90]
TP104.4  TPC90  [C90]
TP105.3  TPC90  [C90]
TP105.4  TPC90  [C90]
TP106.3  TPC90H30  [C90H30]
TP106.4  TPC90H30  [C90H30]
TP107.3  TPC90  [C90]
TP107.4  TPC90  [C90]
TP151.3  TPC90H30  [C90H30]
TP151.4  TPC90H30  [C90H30]
TP152.3  TPC90H30  [C90H30]
TP152.4  TPC90H30  [C90H30]
TP153.3  TPC90H30  [C90H30]
TP153.4  TPC90H30  [C90H30]
X101.3  BU-SMA-GSPECIAL  [BU_SMA_3P]
X101.4  BU-SMA-GSPECIAL  [BU_SMA_3P]

### Nets
+3V3 [Power_<10V]: C152.3.1 IC151.3.8(P:V+) ; also sheet 1,2,3,5
+5V [Power_<10V]: C102.3.1 C102.4.1 IC101.3.7(PWR:V+) IC101.4.7(PWR:V+) ; also sheet 1,2,3
-5V [Power_<10V]: C104.3.2 C104.4.2 IC101.3.4(PWR:V-) IC101.4.4(PWR:V-) ; also sheet 1,2,3
AGND [GND]: C102.3.2 C102.4.2 C104.3.1 C104.4.1 C106.3.2 C106.4.2 C107.3.2 C107.4.2 C152.3.2 C153.3.2 C153.4.2 D101.3.A D101.4.A IC151.3.4(P:V-) JP101.3.1 JP101.3.3 JP101.4.1 JP101.4.3 R152.3.1 R152.4.1 ; supply symbol labelled AGND_ ; also sheet 1,2,3,5
AMP3_FB [Analog_Sig]: IC151.3.2(A:-IN) R151.3.1 R152.3.2 TP152.3.P$1(TP)
AMP3_OUT [Analog_Sig]: IC151.3.1(A:OUT) R151.3.2 R153.3.2 TP151.3.P$1(TP)
AMP4_FB [Analog_Sig]: IC151.3.6(B:-IN) R151.4.1 R152.4.2 TP152.4.P$1(TP)
AMP4_OUT [Analog_Sig]: IC151.3.7(B:OUT) R151.4.2 R153.4.2 TP151.4.P$1(TP)
DIFF_AMP3_OUT [Analog_Sig]: IC101.3.6(A:OUT) R102.3.2 TP105.3.P$1(TP)
DIFF_AMP4_OUT [Analog_Sig]: IC101.4.6(A:OUT) R102.4.2 TP105.4.P$1(TP)
DIODE2_OUT_AI [Analog_Sig]: C153.3.1 R153.3.1 TP153.3.P$1(TP) ; also sheet 1
DIODE3_IN [Analog_Sig]: C106.3.1 D101.3.C IC151.3.3(A:+IN) R102.3.1 TP106.3.P$1(TP)
DIODE3_OUT_AI [Analog_Sig]: C153.4.1 R153.4.1 TP153.4.P$1(TP) ; also sheet 1
DIODE4_IN [Analog_Sig]: C106.4.1 D101.4.C IC151.3.5(B:+IN) R102.4.1 TP106.4.P$1(TP)
GAIN3+ [Analog_Sig]: IC101.3.8(A:RG) R101.3.2 TP104.3.P$1(TP)
GAIN3- [Analog_Sig]: IC101.3.1(A:RG) R101.3.1 TP103.3.P$1(TP)
GAIN4+ [Analog_Sig]: IC101.4.8(A:RG) R101.4.2 TP104.4.P$1(TP)
GAIN4- [Analog_Sig]: IC101.4.1(A:RG) R101.4.1 TP103.4.P$1(TP)
IN3+ [Analog_Sig]: C105.3.2 IC101.3.3(A:+IN) JP101.3.4 L102.3.1
IN3- [Analog_Sig]: C105.3.1 IC101.3.2(A:-IN) JP101.3.2 L101.3.1
IN4+ [Analog_Sig]: C105.4.2 IC101.4.3(A:+IN) JP101.4.4 L102.4.1
IN4- [Analog_Sig]: C105.4.1 IC101.4.2(A:-IN) JP101.4.2 L101.4.1
SENSE2+ [Analog_Sig]: L102.3.2 X101.3.C1 X101.3.C2 ; also sheet 2
SENSE3+ [Analog_Sig]: L102.4.2 X101.4.C1 X101.4.C2 ; also sheet 2
SENSE3- [Analog_Sig]: L101.3.2 X101.3.@GND1(GND) X101.3.@GND2(GND) X101.3.@GND3(GND) X101.3.@GND4(GND) X101.3.GND
SENSE4- [Analog_Sig]: L101.4.2 X101.4.@GND1(GND) X101.4.@GND2(GND) X101.4.@GND3(GND) X101.4.@GND4(GND) X101.4.GND
V_OFF1_3 [Analog_Sig]: R103.3.1 R103.4.1 ; also sheet 2,3
V_OPREF3 [Analog_Sig]: C107.3.1 IC101.3.5(A:REF) R103.3.2 TP107.3.P$1(TP)
V_OPREF4 [Analog_Sig]: C107.4.1 IC101.4.5(A:REF) R103.4.2 TP107.4.P$1(TP)

### Notes on the sheet
- For less offset voltage:
  Replace with 
  TLV2387 or OPA2376
- Measurement channel 2 (not heated JUT)
- tau = 330ns
  fc = 482.3kHz
- tau = 1.2µs
  fc = 132.6kHz
- LT1167:  G= (49k4/Rg)+1
  INA128:  G= (50k/Rg)+1
- Measurement channel 3 (not heated JUT)
- CH3 not supported by Software
- tau = 330ns
  fc = 482.3kHz
- tau = 1.2µs
  fc = 132.6kHz

## Sheet 5 of 5: Thermocouples
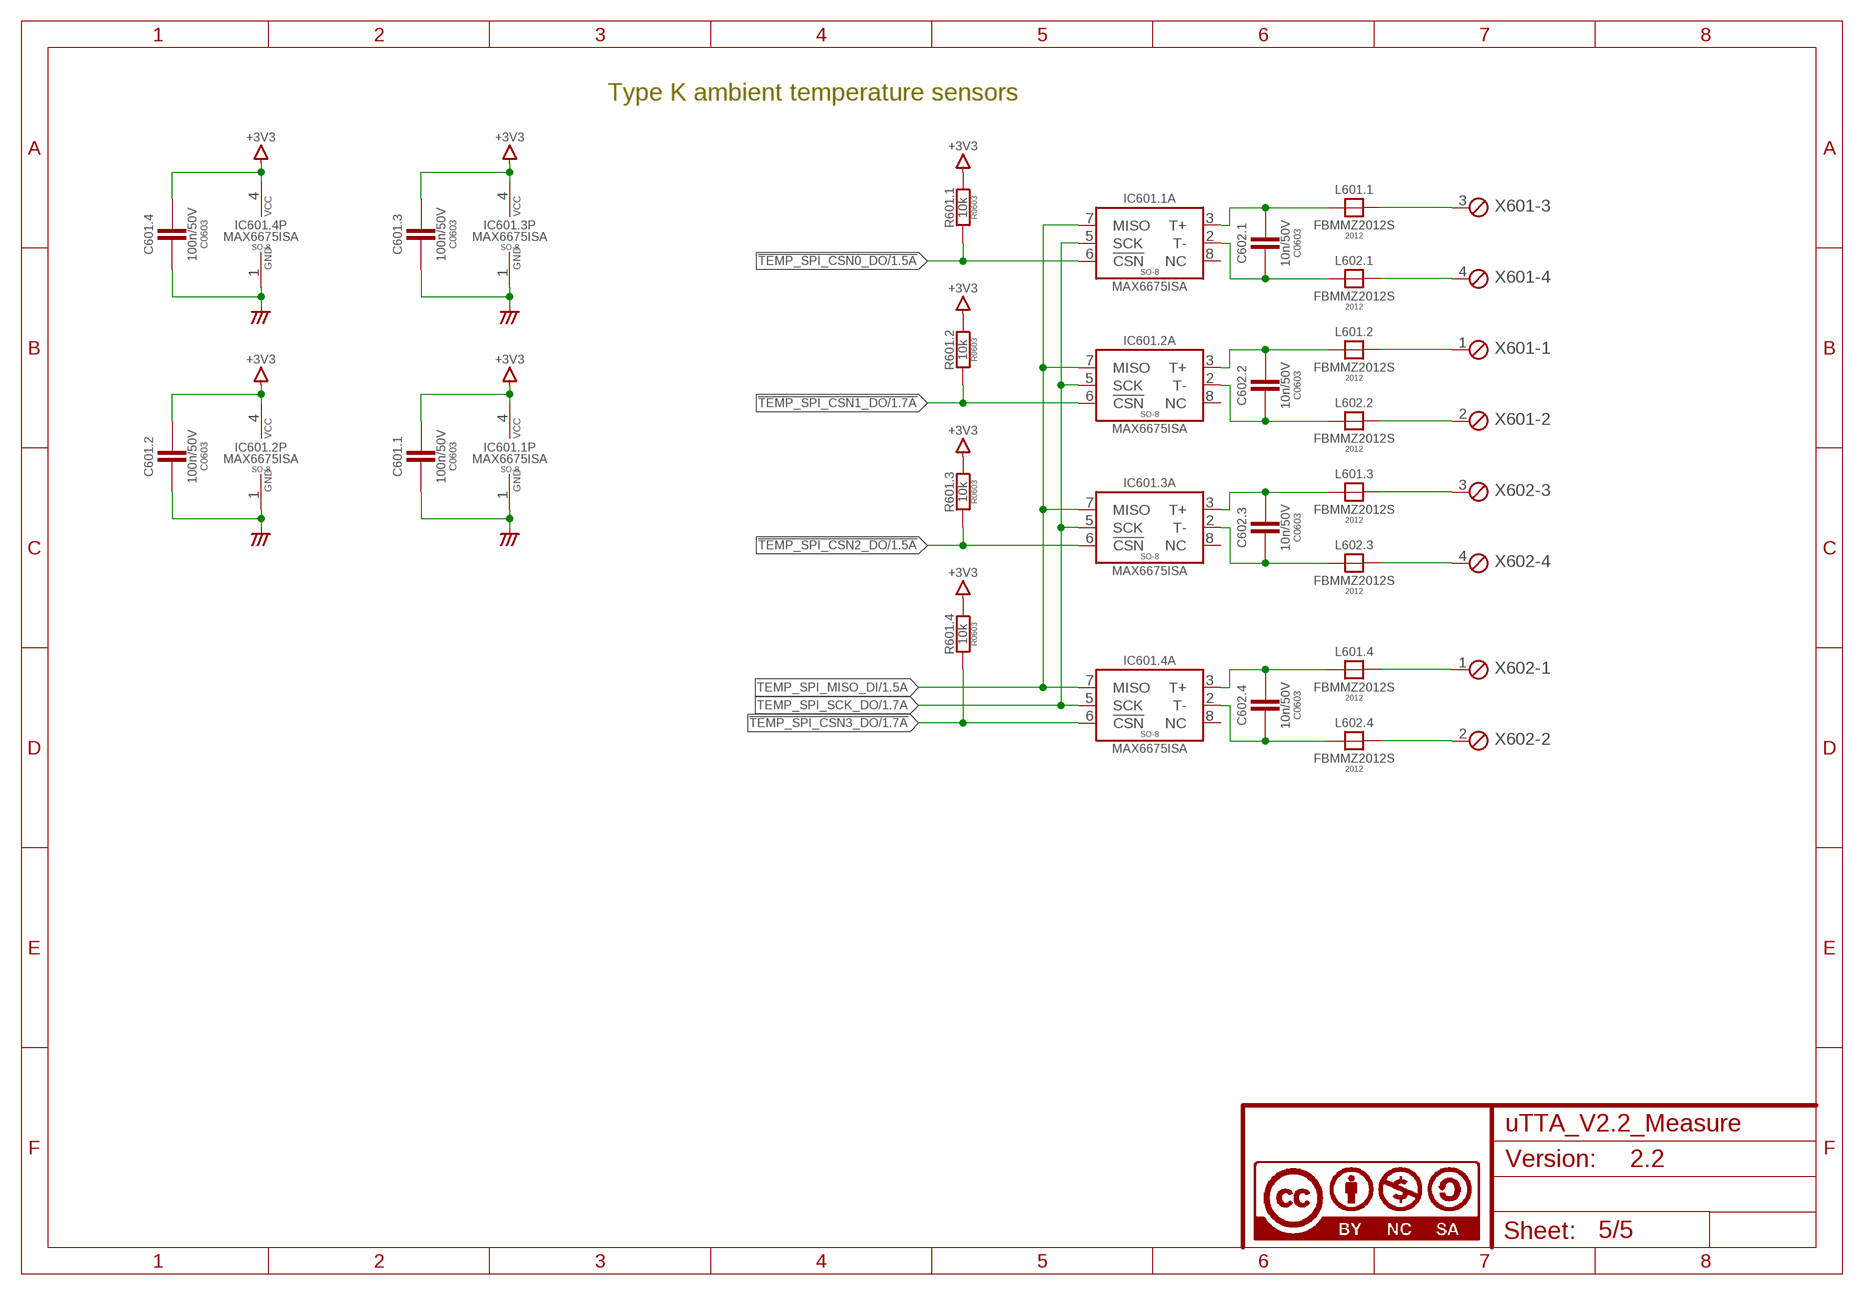
[diagram p4: schematic, sheet 5]

### Parts
C601.1  100n/50V  C-EUC0603  [C0603]
C601.2  100n/50V  C-EUC0603  [C0603]
C601.3  100n/50V  C-EUC0603  [C0603]
C601.4  100n/50V  C-EUC0603  [C0603]
C602.1  10n/50V  C-EUC0603  [C0603]
C602.2  10n/50V  C-EUC0603  [C0603]
C602.3  10n/50V  C-EUC0603  [C0603]
C602.4  10n/50V  C-EUC0603  [C0603]
IC601.1  MAX6675ISA  [SO08]
IC601.2  MAX6675ISA  [SO08]
IC601.3  MAX6675ISA  [SO08]
IC601.4  MAX6675ISA  [SO08]
L601.1  FBMMZ2012S  [FB2012]
L601.2  FBMMZ2012S  [FB2012]
L601.3  FBMMZ2012S  [FB2012]
L601.4  FBMMZ2012S  [FB2012]
L602.1  FBMMZ2012S  [FB2012]
L602.2  FBMMZ2012S  [FB2012]
L602.3  FBMMZ2012S  [FB2012]
L602.4  FBMMZ2012S  [FB2012]
R601.1  10k  R-EU_R0603  [R0603]
R601.2  10k  R-EU_R0603  [R0603]
R601.3  10k  R-EU_R0603  [R0603]
R601.4  10k  R-EU_R0603  [R0603]
X601  MPT4  [4POL254]
X602  MPT4  [4POL254]

### Nets
!TEMP_SPI_CSN0_DO [Digital_Sig]: IC601.1.6(A:!CSN) R601.1.2 ; also sheet 1
!TEMP_SPI_CSN1_DO [Digital_Sig]: IC601.2.6(A:!CSN) R601.2.2 ; also sheet 1
!TEMP_SPI_CSN2_DO [Digital_Sig]: IC601.3.6(A:!CSN) R601.3.2 ; also sheet 1
!TEMP_SPI_CSN3_DO [Digital_Sig]: IC601.4.6(A:!CSN) R601.4.2 ; also sheet 1
+3V3 [Power_<10V]: C601.1.1 C601.2.1 C601.3.1 C601.4.1 IC601.1.4(P:VCC) IC601.2.4(P:VCC) IC601.3.4(P:VCC) IC601.4.4(P:VCC) R601.1.1 R601.2.1 R601.3.1 R601.4.1 ; also sheet 1,2,3,4
AGND [GND]: C601.1.2 C601.2.2 C601.3.2 C601.4.2 IC601.1.1(P:GND) IC601.2.1(P:GND) IC601.3.1(P:GND) IC601.4.1(P:GND) ; supply symbol labelled AGND_ ; also sheet 1,2,3,4
TC1+ [Analog_Sig]: L601.4.2 X602.1
TC1- [Analog_Sig]: L602.4.2 X602.2
TC2+ [Analog_Sig]: L601.3.2 X602.3
TC2- [Analog_Sig]: L602.3.2 X602.4
TC3+ [Analog_Sig]: L601.2.2 X601.1
TC3- [Analog_Sig]: L602.2.2 X601.2
TC4+ [Analog_Sig]: L601.1.2 X601.3
TC4- [Analog_Sig]: L602.1.2 X601.4
TEMP_SPI_MISO_DI [Digital_Sig]: IC601.1.7(A:MISO) IC601.2.7(A:MISO) IC601.3.7(A:MISO) IC601.4.7(A:MISO) ; also sheet 1
TEMP_SPI_SCK_DO [Digital_Sig]: IC601.1.5(A:SCK) IC601.2.5(A:SCK) IC601.3.5(A:SCK) IC601.4.5(A:SCK) ; also sheet 1,2
TK1_N [Analog_Sig]: C602.4.2 IC601.4.2(A:T-) L602.4.1
TK1_P [Analog_Sig]: C602.4.1 IC601.4.3(A:T+) L601.4.1
TK2_N [Analog_Sig]: C602.3.2 IC601.3.2(A:T-) L602.3.1
TK2_P [Analog_Sig]: C602.3.1 IC601.3.3(A:T+) L601.3.1
TK3_N [Analog_Sig]: C602.2.2 IC601.2.2(A:T-) L602.2.1
TK3_P [Analog_Sig]: C602.2.1 IC601.2.3(A:T+) L601.2.1
TK4_N [Analog_Sig]: C602.1.2 IC601.1.2(A:T-) L602.1.1
TK4_P [Analog_Sig]: C602.1.1 IC601.1.3(A:T+) L601.1.1
Unconnected: IC601.1.8(A:NC) IC601.2.8(A:NC) IC601.3.8(A:NC) IC601.4.8(A:NC)

### Notes on the sheet
- Type K ambient temperature sensors

## Power pins joined to a net without a drawn wire
5V: U11.L_5V(A:5V)
AGND: U11.R_AGND(B:AGND)
E5V: U11.L_E5V(A:E5V)
U5V: U11.R_U5V(B:U5V)
VBAT: U11.L_VBAT(A:VBAT)
VDD: U11.L_VDD(A:VDD)
VIN2: U11.L_VIN(A:VIN2)

## Library data of the parts
C1-C5 = A_Kondensatoren:C-EU: CAPACITOR, European symbol; PACKAGE: C0805
C102.1-C102.4 C104.1-C104.4 C105.1-C105.4 C106.1-C106.4 C107.1-C107.4 C121 C122.1 C123.1 C152.1 C152.3 C153.1-C153.4 C301-C307 C321.1 C321.2 C351.1-C351.4 C352.1-C352.4 C601.1-C601.4 C602.1-C602.4 = A_Kondensatoren:C-EU: CAPACITOR, European symbol; PACKAGE: C0603
D101.1-D101.4 D351.1-D351.4 = A_Dioden:SD101; PACKAGE: SOD-323
D151 D152 = A_Dioden:MM3Z*T1G; PACKAGE: SOD323
IC101.1-IC101.4 = A_Linear_Technology:LT1167; PACKAGE: SO-8
IC151.1 IC151.3 = A_Microchip:MCP602: Single Op Amp 2.7V to 6.0V Single Supply CMOS Source: http://ww1.microchip.com/downloads/en/DeviceDoc/21314g.pdf; PACKAGE: SO-08
IC301 = A_Analog_Devices:AD5664R: D/A-Wandler 4 Kanal 16bit SPI-Interface Lieferant: RS-Components Artikelnummer: 709-5960
IC302 = A_Linear_Technology:LT1004?*; PACKAGE: TO-92
IC303 = A_Linear_IC:TL074: OP AMP; PACKAGE: SO-14
IC351.1-IC351.4 = A_Linear_IC:OPA2156; PACKAGE: SO-08
IC601.1-IC601.4 = A_MAXIM_IC:MAX6675*; PACKAGE: SO-8
JP101.1-JP101.4 = Connectors jumper:JP2QE: JUMPER
L101.1-L101.4 L102.1-L102.4 L121 L301 L601.1-L601.4 L602.1-L602.4 = A_Ferrite:FB: FERRITE BEAD; PACKAGE: 2012
LED1-LED3 = A_LED:LED: LED OSRAM: - CHIPLED LG R971, LG N971, LY N971, LG Q971, LY Q971, LO R971, LY R971 LH N974, LH R974 LS Q976, LO Q976, LY Q976 LO Q996 - Hyper CHIPLED LW Q18S LB Q993, LB Q99A, LB R99A - SideLED LS A670, LO A670, LY A670, LG A670, LP A670 LB A673, LV A673, LT A673, LW A673 LH A674 LY A675 LS A676, LA A676, LO A676, LY A676, LW A676 LS A679, LY A679, LG A679 - Hyper Micro SIDELED® LS Y876, LA Y876, LO Y876, LY Y876 LT Y87S - SmartLED LW L88C, LW L88S LB L89C, LB L89S, LG L890 LS L89K, LO L89K, LY L89K LS L896, LA L896, LO L896, LY L896 - TOPLED LS T670, LO T670, LY T670, LG T670, LP T670 LSG T670, LSP T670, LSY T670, LOP T670, LYG T670 LG T671, LOG T671, LSG T671 LB T673, LV T673, LT T673, LW T673 LH T674 LS T676, LA T676, LO T676, LY T676, LB T676, LH T676, LSB T676, LW T676 LB T67C, LV T67C, LT T67C, LS T67K, LO T67K, LY T67K, LW E67C LS E67B, LA E67B, LO E67B, LY E67B, LB E67C, LV E67C, LT E67C LW T67C LS T679, LY T679, LG T679 LS T770, LO T770, LY T770, LG T770, LP T770 LB T773, LV T773, LT T773, LW T773 LH T774 LS E675, LA E675, LY E675, LS T675 LS T776, LA T776, LO T776, LY T776, LB T776 LHGB T686 LT T68C, LB T68C - Hyper Mini TOPLED® LB M676 - Mini TOPLED Santana® LG M470 LS M47K, LO M47K, LY M47K Source: http://www.osram.convergy.de LUXEON: - LUMILED® LXK2-PW12-R00, LXK2-PW12-S00, LXK2-PW14-U00, LXK2-PW14-V00 LXK2-PM12-R00, LXK2-PM12-S00, LXK2-PM14-U00 LXK2-PE12-Q00, LXK2-PE12-R00, LXK2-PE12-S00, LXK2-PE14-T00, LXK2-PE14-U00 LXK2-PB12-K00, LXK2-PB12-L00, LXK2-PB12-M00, LXK2-PB14-N00, LXK2-PB14-P00, LXK2-PB14-Q00 LXK2-PR12-L00, LXK2-PR12-M00, LXK2-PR14-Q00, LXK2-PR14-R00 LXK2-PD12-Q00, LXK2-PD12-R00, LXK2-PD12-S00 LXK2-PH12-R00, LXK2-PH12-S00 LXK2-PL12-P00, LXK2-PL12-Q00, LXK2-PL12-R00 Source: www.luxeon.com KINGBRIGHT: KA-3528ASYC Source: www.kingbright.com
R1-R5 R102.1-R102.4 R103.1-R103.4 R121.1 R153.1-R153.4 R156B R157-R160 R301-R303 R306 R322.1 R322.2 R601.1-R601.4 = A_Resistor:R-EU_: RESISTOR, European symbol; PACKAGE: R0603
R101.1-R101.4 R355.1-R355.4 = A_Resistor:R-EU_: RESISTOR, European symbol; PACKAGE: R0805; TOLERANCE: 0.1%
R151.1-R151.4 R152.2-R152.4 R154A R154B R155A R321.1 R321.2 R326.1 R326.2 R351.1-R351.4 R352.1-R352.4 R353.1-R353.4 R354.1-R354.4 = A_Resistor:R-EU_: RESISTOR, European symbol; PACKAGE: R0603; TOLERANCE: 0.1%
S1 S11 = switch-omron:10-XX: OMRON SWITCH; MPN: B3F-1000; OC_FARNELL: 176432; OC_NEWARK: 36M3542
S351.2-S351.4 = A_Schalter:SS_ESP101
T151 = A_Transistoren:BSS138PS: BSS138PS Dual N-CH MOSFET 60V, 320mA, 280mW, SOT363 Rdson: 0.9 - 1.6 Ohm Reichelt: BSS138PS NXP Preis: 0,18€; PACKAGE: SOT-363
TP1 TP3-TP12 TP17-TP24 TP103.1-TP103.4 TP104.1-TP104.4 TP105.1-TP105.4 TP106.1-TP106.4 TP107.1-TP107.4 TP151.1-TP151.4 TP152.1-TP152.4 TP153 TP153.1-TP153.4 TP154 TP301-TP306 TP321.1 TP321.2 TP322.1 TP322.2 TP351.1-TP351.4 TP352.1-TP352.4 TP353.1-TP353.4 TP354.2-TP354.4 TP355.1-TP355.4 TP9354.1 = A_Testpoint:TP
U11 = A_Stm32nucleo:NUCLEO_F103_BOT
U121.1 = XMC4500_Relax-V1:W25Q80BV
X101.1-X101.4 = A_Steckverbinder:BU-SMA-G: FEMALE SMA CONNECTOR Radiall distributor RS 193-9117
X601 X602 = Connectors Phoenix-254:MPT4: PHOENIX CONNECTOR

## Net classes
0 default: width 0.61 mm, drill 0.3 mm, clearance 0.2 mm
1 Analog_Sig: width 0.25 mm, drill 0.3 mm, clearance 0.2 mm to class 0, clearance 0.2 mm
2 Digital_Sig: width 0.25 mm, drill 0.3 mm, clearance 0.2 mm to class 0, clearance 0.3 mm to class 1, clearance 0.2 mm
3 Power_>10V: width 0.4 mm, drill 0.3 mm, clearance 0.2 mm to class 0, clearance 0.25 mm to class 1, clearance 0.3 mm to class 2, clearance 0.2 mm
4 Power_<10V: width 0.4 mm, drill 0.3 mm, clearance 0.2 mm to class 0, clearance 0.25 mm to class 1, clearance 0.3 mm to class 2, clearance 0.25 mm to class 3, clearance 0.2 mm
5 SPI: width 0.25 mm, drill 0.3 mm, clearance 0.3 mm to class 0, clearance 0.4 mm to class 1, clearance 0.3 mm to class 2, clearance 0.4 mm to class 3, clearance 0.4 mm to class 4, clearance 0.25 mm
6 High_Curr: width 3 mm, drill 0.3 mm, clearance 0.4 mm to class 0, clearance 0.4 mm to class 1, clearance 0.4 mm to class 2, clearance 0.4 mm to class 3, clearance 0.4 mm to class 4, clearance 0.4 mm to class 5, clearance 0.4 mm
7 GND_ISO: width 0.4 mm, drill 0.3 mm, clearance 0.6 mm to class 0, clearance 0.6 mm to class 1, clearance 0.6 mm to class 2, clearance 0.6 mm to class 3, clearance 0.6 mm to class 4, clearance 0.6 mm to class 5, clearance 0.6 mm to class 6, clearance 0.3 mm
8 PWR_ISO: width 0.3 mm, drill 0.3 mm, clearance 0.6 mm to class 0, clearance 0.6 mm to class 1, clearance 0.3 mm to class 2, clearance 0.6 mm to class 3, clearance 0.6 mm to class 4, clearance 0.6 mm to class 5, clearance 0.6 mm to class 6, clearance 0.3 mm to class 7, clearance 0.3 mm
9 GND: width 0.3 mm, drill 0.3 mm, clearance 0.2 mm to class 0, clearance 0.2 mm to class 1, clearance 0.2 mm to class 2, clearance 0.3 mm to class 3, clearance 0.2 mm to class 4, clearance 0.25 mm to class 5, clearance 0.25 mm to class 6, clearance 0.4 mm to class 7, clearance 0.4 mm to class 8, clearance 0.2 mm
10 USB: width 0.3 mm, drill 0.3 mm, clearance 0.4 mm to class 0, clearance 0.4 mm to class 1, clearance 0.4 mm to class 2, clearance 0.4 mm to class 3, clearance 0.4 mm to class 4, clearance 0.4 mm to class 5, clearance 0.4 mm to class 6, clearance 0.6 mm to class 7, clearance 0.6 mm to class 8, clearance 0.4 mm to class 9, clearance 0.4 mm